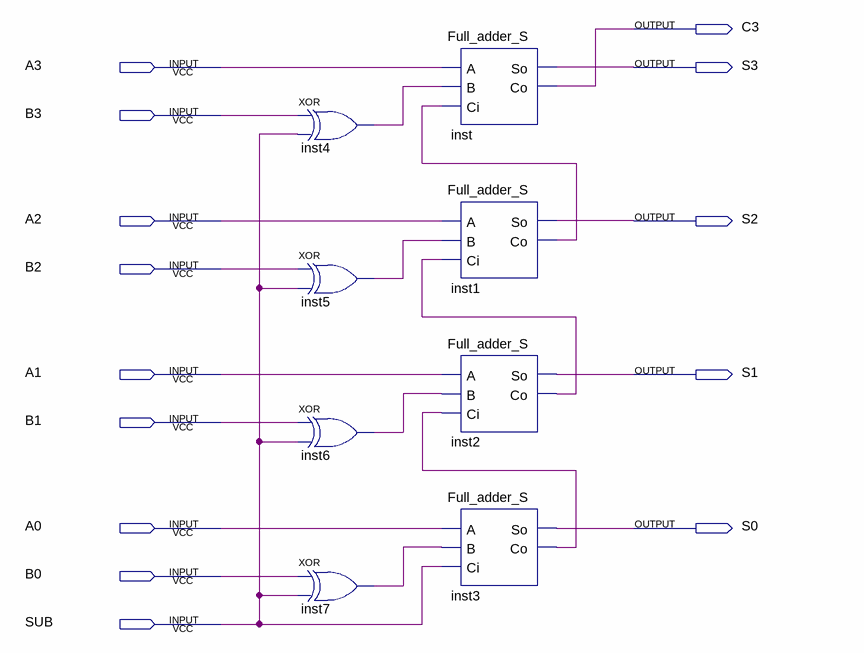
[diagram p0: schematic sheet]
// Quartus schematic four_bit_add_sub.bdf as structural Verilog: 8 symbols, 14 pins
module four_bit_add_sub (
  input  A3,
  input  B3,
  input  A2,
  input  B2,
  input  A1,
  input  B1,
  input  A0,
  input  B0,
  input  SUB,
  output C3,
  output S3,
  output S2,
  output S1,
  output S0
);

  wire inst1_co, inst2_co, inst3_co, inst4_out, inst5_out, inst6_out, inst7_out;

  xor inst4 (inst4_out, B3, SUB);
  xor inst5 (inst5_out, B2, SUB);
  xor inst6 (inst6_out, B1, SUB);
  xor inst7 (inst7_out, B0, SUB);
  Full_adder_S inst (.A(A3), .B(inst4_out), .Ci(inst1_co), .So(S3), .Co(C3));
  Full_adder_S inst1 (.A(A2), .B(inst5_out), .Ci(inst2_co), .So(S2), .Co(inst1_co));
  Full_adder_S inst2 (.A(A1), .B(inst6_out), .Ci(inst3_co), .So(S1), .Co(inst2_co));
  Full_adder_S inst3 (.A(A0), .B(inst7_out), .Ci(SUB), .So(S0), .Co(inst3_co));
endmodule
